# EAGLE schematic MAIN (EAGLE 7.1.0)
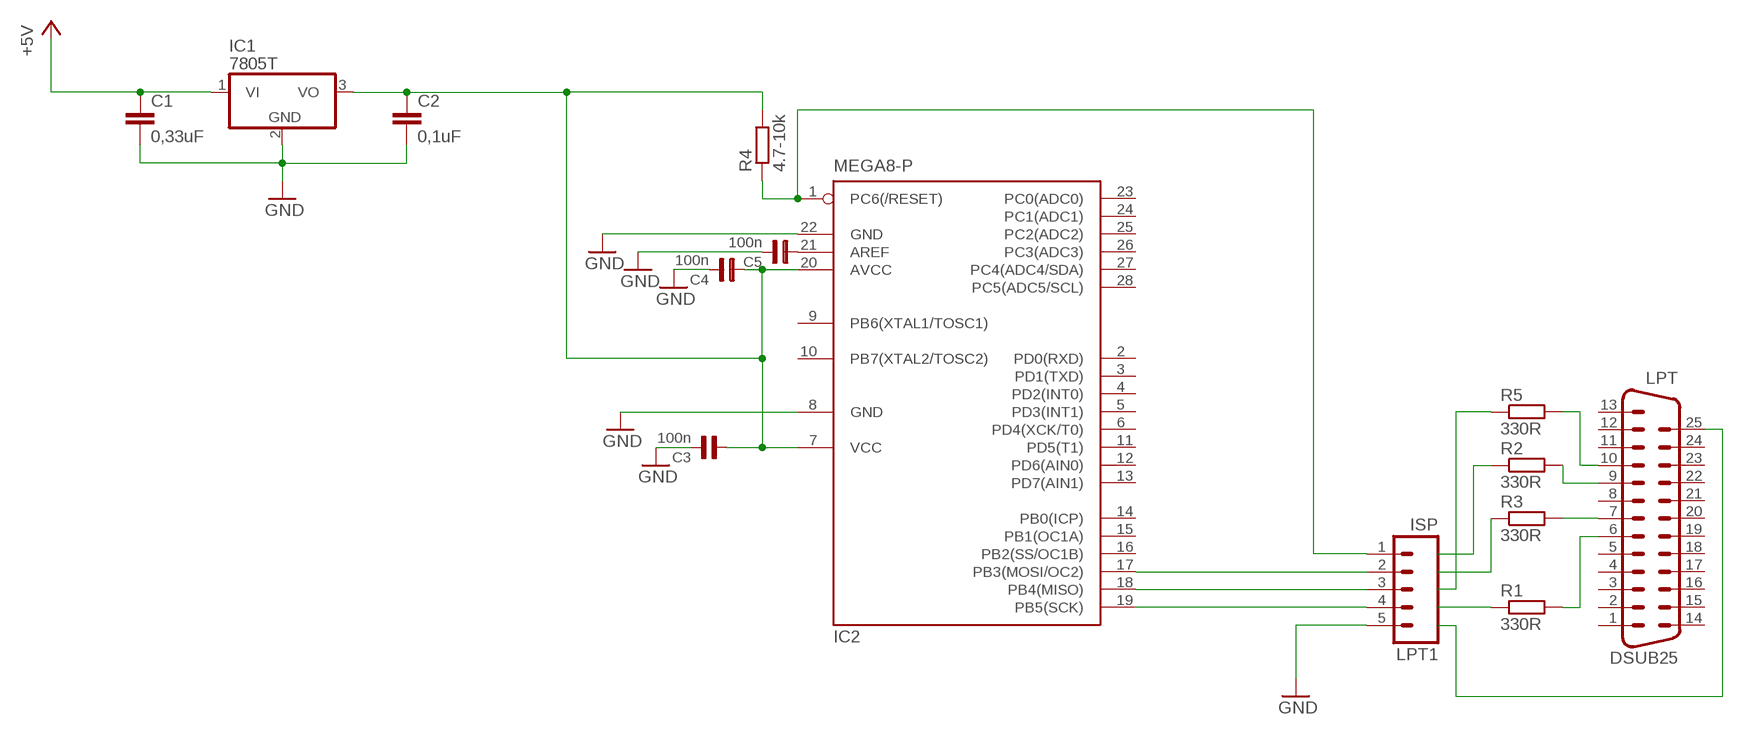
[diagram p0: schematic, sheet 1]

## Parts
C1  0,33uF  C2.5/5  [C2.5-5]
C2  0,1uF  C2.5/5  [C2.5-5]
C3  100n  C0204  [0204]
C4  100n  C0204  [0204]
C5  100n  C0204  [0204]
DSUB25  LPT  M25V  [M25V]
IC1  7805T  [TO220H]
IC2  MEGA8-P  [DIL28-3]
LPT1  ISP  M05  [05P]
R1  330R  R-EU_0204/2V  [0204V]
R2  330R  R-EU_0204/2V  [0204V]
R3  330R  R-EU_0204/2V  [0204V]
R4  4.7-10k  R-EU_0207/10  [0207/10]
R5  330R  R-EU_0204/2V  [0204V]

## Nets
+5V: C1.1 IC1.1(VI)
GND: C3.2 C4.2 C5.2 IC2.8(GND) IC2.22(GND)
N$1: C2.1 C3.1 C4.1 IC1.3(VO) IC2.7(VCC) IC2.20(AVCC) R4.2
N$2: IC2.1(PC6(/RESET)) LPT1.1 R4.1
N$3: C1.2 C2.2 IC1.2(GND) ; supply symbol labelled GND
N$4: LPT1.5
N$5: IC2.18(PB4(MISO)) LPT1.3
N$6: IC2.19(PB5(SCK)) LPT1.4
N$7: IC2.17(PB3(MOSI/OC2)) LPT1.2
N$8: DSUB25.25
N$9: R1.1
N$10: C5.1 IC2.21(AREF)
N$11: DSUB25.6 R1.2
N$12: DSUB25.7 R3.2
N$13: R3.1
N$14: DSUB25.9 R2.2
N$15: R2.1
N$16: DSUB25.10 R5.2
N$17: R5.1
Unconnected: DSUB25.1 DSUB25.2 DSUB25.3 DSUB25.4 DSUB25.5 DSUB25.8 DSUB25.11 DSUB25.12 DSUB25.13 DSUB25.14 DSUB25.15 DSUB25.16 DSUB25.17 DSUB25.18 DSUB25.19 DSUB25.20 DSUB25.21 DSUB25.22 DSUB25.23 DSUB25.24 IC2.2(PD0(RXD)) IC2.3(PD1(TXD)) IC2.4(PD2(INT0)) IC2.5(PD3(INT1)) IC2.6(PD4(XCK/T0)) IC2.9(PB6(XTAL1/TOSC1)) IC2.10(PB7(XTAL2/TOSC2)) IC2.11(PD5(T1)) IC2.12(PD6(AIN0)) IC2.13(PD7(AIN1)) IC2.14(PB0(ICP)) IC2.15(PB1(OC1A)) IC2.16(PB2(SS/OC1B)) IC2.23(PC0(ADC0)) IC2.24(PC1(ADC1)) IC2.25(PC2(ADC2)) IC2.26(PC3(ADC3)) IC2.27(PC4(ADC4/SDA)) IC2.28(PC5(ADC5/SCL))

## Library data of the parts
C1 C2 = capacitor-wima:C: CAPACITOR naming: grid - package width
C3-C5 = capsmd:C0204: smallest SMD capacitor
DSUB25 = con-subd:M25: SUB-D; OC_FARNELL: unknown; OC_NEWARK: unknown
IC1 = linear:78*: Positive VOLTAGE REGULATOR Source: http://cache.national.com/ds/LM/LM78L05.pdf http://www.fairchildsemi.com/ds/LM/LM7805.pdf
IC2 = atmel:MEGA8-P: MICROCONTROLLER 8 Kbytes FLASH, 1 kbytes SRAM, 512 bytes EEPROM, USART, 4-channel 10 bit ADC, 2-channel 8 bit ADC Pin compatible with Atmega48, ATMega88, ATMega168 Source: avr.lbr; OC_FARNELL: unknown; OC_NEWARK: unknown
LPT1 = con-amp-quick:M05: AMP QUICK CONNECTOR; OC_FARNELL: unknown; OC_NEWARK: unknown
R1-R5 = rcl:R-EU_: RESISTOR, European symbol